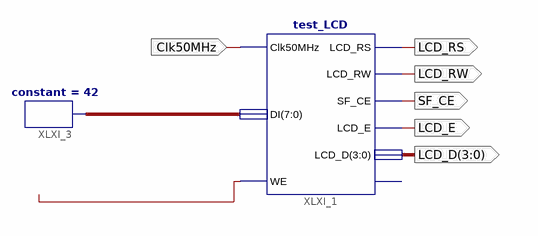
[diagram p0: schematic sheet 1]
// Xilinx ISE schematic projekt.sch (spartan3e) as structural Verilog: 2 symbols, 6 ports
module projekt (
  input  Clk50MHz,
  output LCD_RS,
  output LCD_RW,
  output SF_CE,
  output LCD_E,
  output [3:0] LCD_D
);

  wire XLXN_1;
  wire [7:0] XLXN_3;

  test_LCD XLXI_1 (
    .Clk50MHz(Clk50MHz), .DI(XLXN_3), .WE(XLXN_1), .LCD_RS(LCD_RS), .LCD_RW(LCD_RW), .SF_CE(SF_CE),
    .LCD_E(LCD_E), .LCD_D(LCD_D));  // open: Busy
  constant #(.CValue("42")) XLXI_3 (.O(XLXN_3));
endmodule
